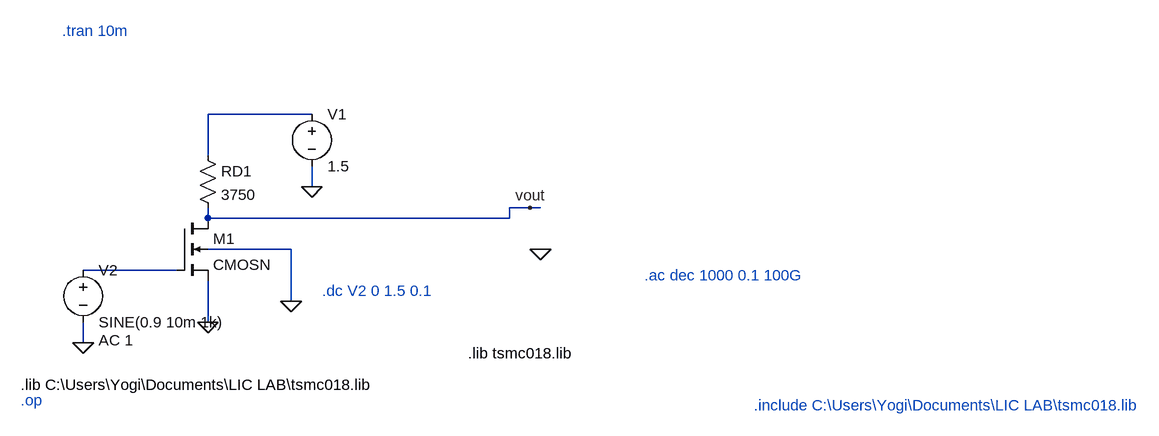
[diagram p0: schematic EXP-01-CS-Amplifier.asc]
EXP-01-CS-Amplifier.asc, the LTspice schematic file:
Version 4.1
SHEET 1 1696 680
WIRE 352 -128 192 -128
WIRE 192 -64 192 -128
WIRE 352 -16 352 -48
WIRE 688 16 656 16
WIRE 704 16 688 16
WIRE 192 32 192 16
WIRE 656 32 656 16
WIRE 656 32 192 32
WIRE 320 80 192 80
WIRE 144 112 0 112
WIRE 320 160 320 80
WIRE 192 192 192 128
WIRE 0 224 0 192
FLAG 192 192 0
FLAG 352 -16 0
FLAG 0 224 0
FLAG 704 80 0
FLAG 320 160 0
FLAG 688 16 vout
SYMBOL nmos4 144 32 R0
SYMATTR InstName M1
SYMATTR Value CMOSN
SYMATTR Value2 l=180n w=1.46u
SYMBOL res 176 -80 R0
SYMATTR InstName RD1
SYMATTR Value 3750
SYMBOL voltage 352 -144 R0
WINDOW 123 0 0 Left 0
WINDOW 39 0 0 Left 0
SYMATTR InstName V1
SYMATTR Value 1.5
SYMBOL voltage 0 96 R0
WINDOW 123 24 124 Left 2
WINDOW 39 0 0 Left 0
SYMATTR Value2 AC 1
SYMATTR InstName V2
SYMATTR Value SINE(0.9 10m 1k)
TEXT -96 288 Left 2 !.lib C:\\Users\\Yogi\\Documents\\LIC LAB\\tsmc018.lib
TEXT -96 312 Left 2 ;.op
TEXT 368 144 Left 2 ;.dc V2 0 1.5 0.1
TEXT -32 -256 Left 2 ;.tran 10m
TEXT 864 120 Left 2 ;.ac dec 1000 0.1 100G
TEXT 1032 320 Left 2 ;.include C:\\Users\\Yogi\\Documents\\LIC LAB\\tsmc018.lib
TEXT 592 240 Left 2 !.lib tsmc018.lib

The netlist it stands for:
* EXP-01-CS-Amplifier.asc
M1 vout N002 0 0 CMOSN l=180n w=1.46u
RD1 N001 vout 3750
V1 N001 0 1.5
V2 N002 0 SINE(0.9 10m 1k) AC 1
.model NMOS NMOS
.model PMOS PMOS
.lib standard.mos
.lib C:\Users\Yogi\Documents\LIC LAB\tsmc018.lib
* .op
* .dc V2 0 1.5 0.1
* .tran 10m
* .ac dec 1000 0.1 100G
* .include C:\Users\Yogi\Documents\LIC LAB\tsmc018.lib
.lib tsmc018.lib
.backanno
.end